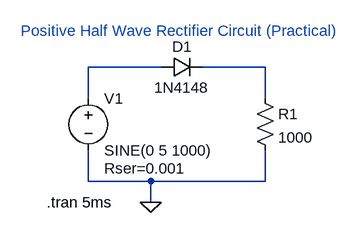
[diagram p0: schematic Assignment 3a (i).asc]
Assignment 3a (i).asc, the LTspice schematic file:
Version 4.1
SHEET 1 880 680
WIRE 192 64 80 64
WIRE 352 64 256 64
WIRE 80 112 80 64
WIRE 352 112 352 64
WIRE 80 240 80 192
WIRE 176 240 80 240
WIRE 352 240 352 192
WIRE 352 240 176 240
WIRE 176 272 176 240
FLAG 176 272 0
SYMBOL voltage 80 96 R0
WINDOW 123 0 0 Left 2
WINDOW 39 24 124 Left 2
SYMATTR SpiceLine Rser=0.001
SYMATTR InstName V1
SYMATTR Value SINE(0 5 1000)
SYMBOL res 336 96 R0
SYMATTR InstName R1
SYMATTR Value 1000
SYMBOL diode 192 80 R270
WINDOW 0 32 32 VTop 2
WINDOW 3 0 32 VBottom 2
SYMATTR InstName D1
SYMATTR Value 1N4148
TEXT 16 272 Left 2 !.tran 5ms
TEXT -24 8 Left 2 ;Positive Half Wave Rectifier Circuit (Practical)

The netlist it stands for:
* Assignment 3a (i).asc
V1 N001 0 SINE(0 5 1000) Rser=0.001
R1 N002 0 1000
D1 N001 N002 1N4148
.model D D
.lib standard.dio
.tran 5ms
* Positive Half Wave Rectifier Circuit (Practical)
.backanno
.end